# Altium schematic sheet DRV8825PWPR1_DRV8825PWPR.schdoc
size 127 x 101 mm
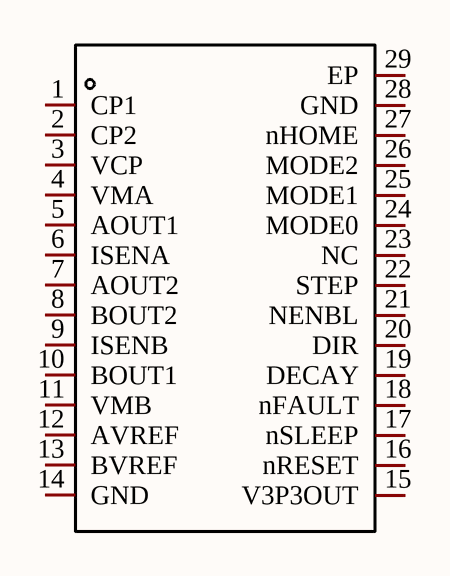
[diagram p0: DRV8825PWPR1_DRV8825PWPR.schdoc]

## Parts
U?  DRV8825PWPR  [HTSSOP-28_L9.7-W4.4-P0.65-LS6.4-BL-EP]  (value not drawn)

## Nets

Not connected (* = marked no-connect by the designer): U? 1(CP1) 2(CP2) 3(VCP) 4(VMA) 5(AOUT1) 6(ISENA) 7(AOUT2) 8(BOUT2) 9(ISENB) 10(BOUT1) 11(VMB) 12(AVREF) 13(BVREF) 14(GND) 15(V3P3OUT) 16(nRESET) 17(nSLEEP) 18(nFAULT) 19(DECAY) 20(DIR) 21(NENBL) 22(STEP) 23(NC) 24(MODE0) 25(MODE1) 26(MODE2) 27(nHOME) 28(GND) 29(EP)

## Library data of the parts
U? = DRV8825PWPR: Manufacturer: TI(德州仪器); Add into BOM: yes; Symbol: DRV8825PWPR; Device: DRV8825PWPR; LCSC Part Name: 2.5A 45V电机驱动芯片; Supplier Part: C81582; Manufacturer Part: DRV8825PWPR; Supplier Footprint: HTSSOP-28-EP; JLCPCB Part Class: Extended Part; Datasheet: https://www.ti.com/cn/lit/gpn/drv8825; Supplier: LCSC; Convert to PCB: yes